# EAGLE board ddk-final-1 (EAGLE 6.4), part 1 of 2
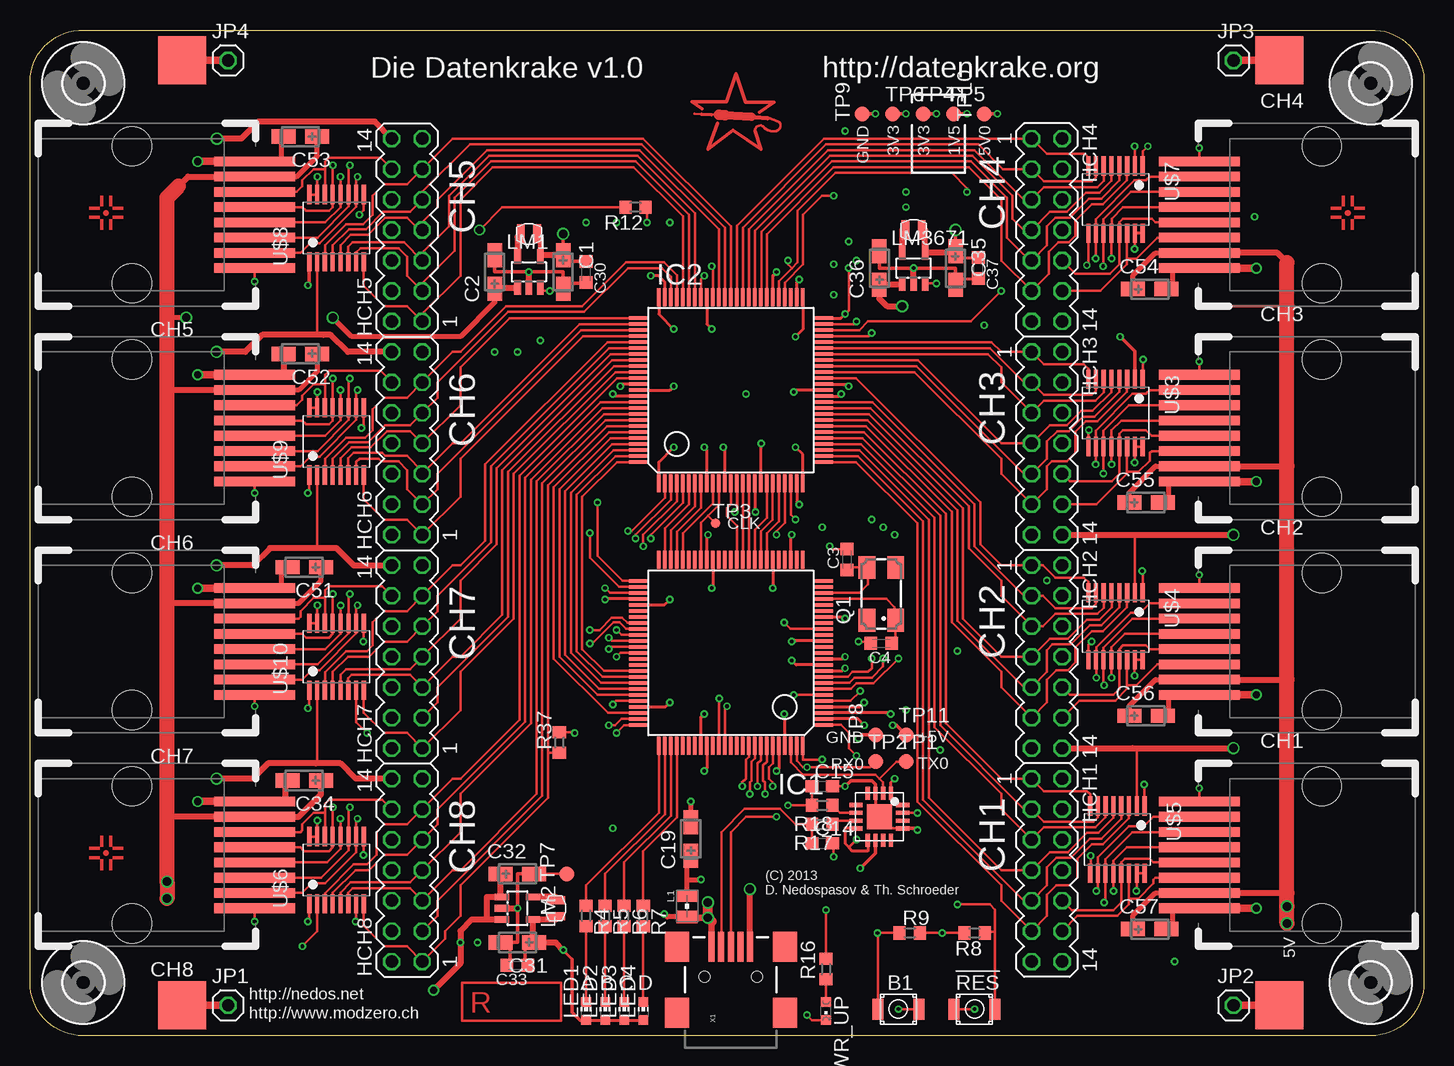
[diagram p5: board, top side]
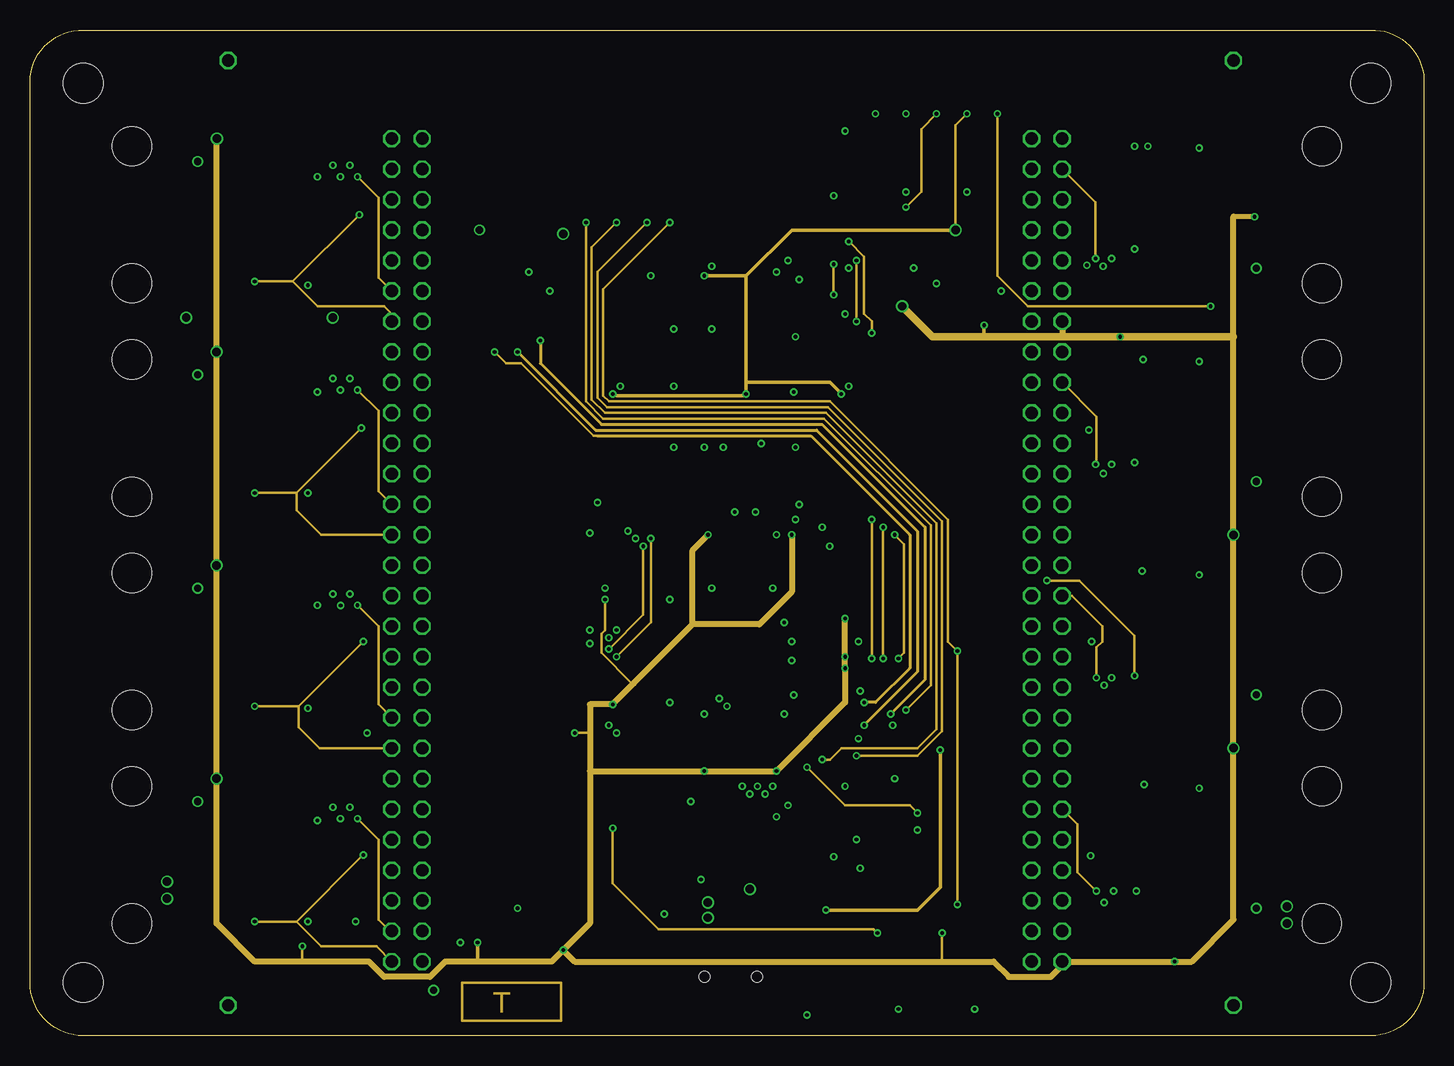
[diagram p6: board, inner layer Route2]
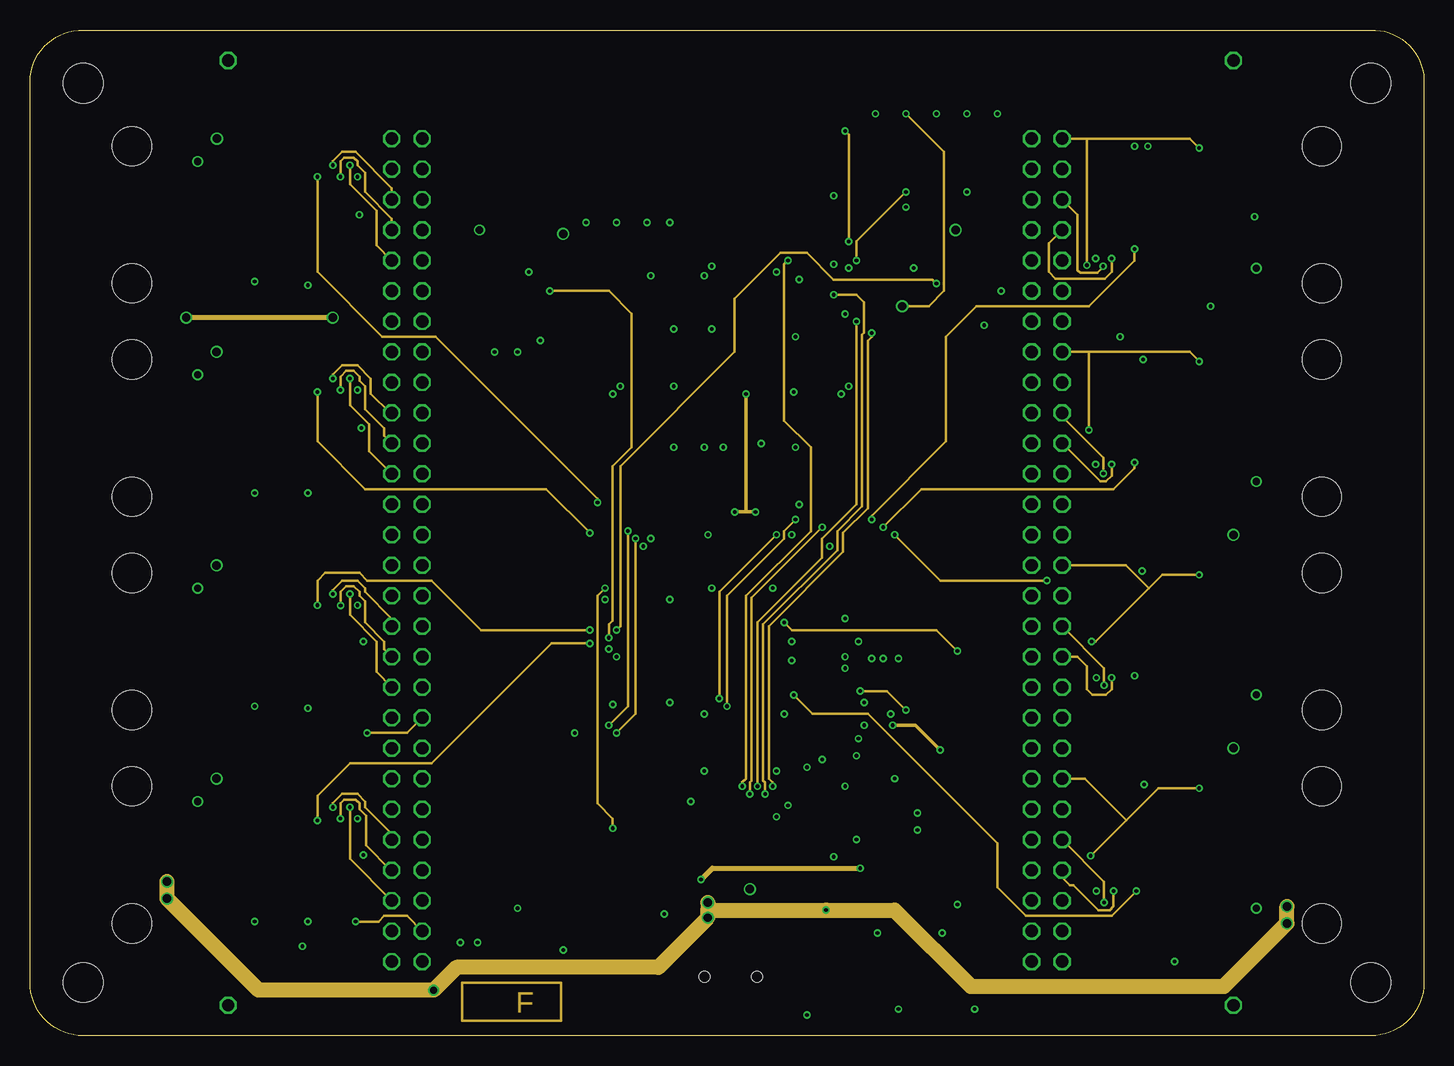
[diagram p7: board, inner layer Route15]
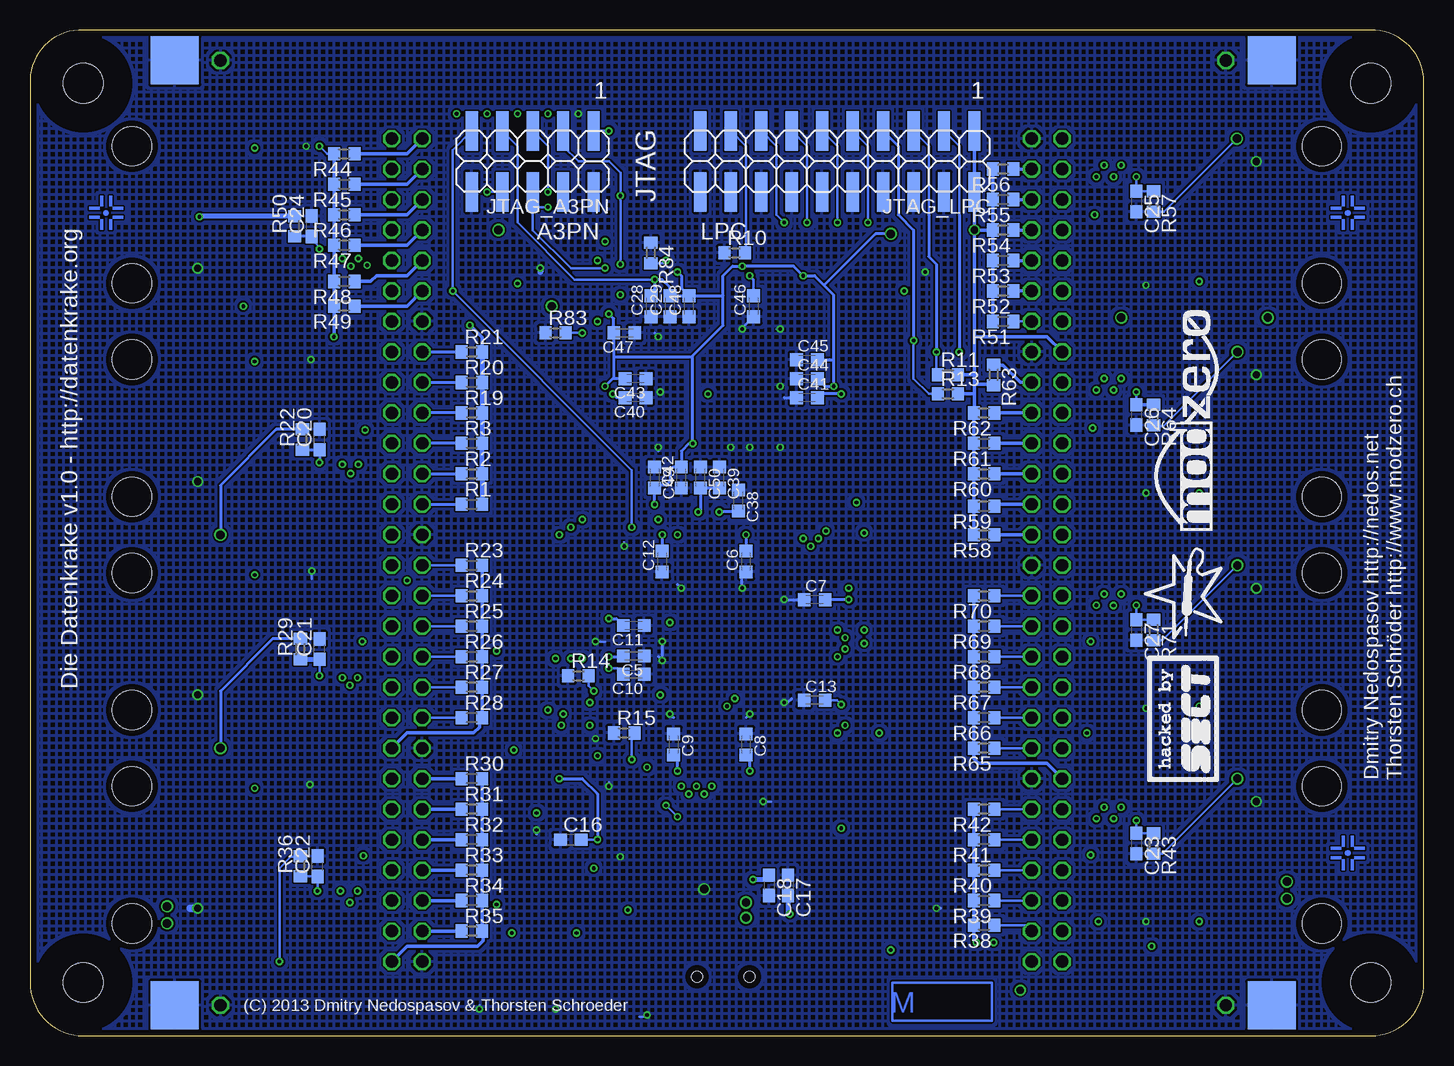
[diagram p8: board, bottom side, seen from below]

Size 116.2 x 83.82 mm. Coordinates in mm from the lower left corner, seen from the top.
Outline: 111.76,83.82 arc-90 116.2,79.69 116.2,4.45 arc-90 111.76,0 4.45,0 arc-90 0,4.45 0,79.53 arc-90 4.45,83.82 111.76,83.82
Copper layers (1+2*15+16): Top 0.035mm / dielectric 0.36mm / Route2 0.035mm / dielectric 0.71mm / Route15 0.035mm / dielectric 0.36mm / Bottom 0.035mm
Design rules "Eagle-DRU - 1203 - LeitOn - 04 layers *": minimum track width 6mil, minimum drill 0.3mm, track to track 6mil, track to pad 6mil, pad to pad 6mil, via to via 6mil, smd to smd 6mil, copper to edge 20mil, drill to drill 10mil, minimum pad ring 8mil, minimum via ring 6mil, stop-mask expansion 3mil, vias tented up to drill 13mil, thermal gap 8mil

## Footprints (pad centres in the part's own frame; a part is rotated, then mirrored left to right if it is on the bottom)
CT3216 = smd 2 x 1.2: + -1.4,0; - 1.4,0
C0603K = smd 1.05 x 1.08: 1 -0.875,0; 2 0.875,0
C0603 = smd 1.1 x 1: 1 -0.85,0; 2 0.85,0
95501 = smd 6.75 x 0.8: P1 -8.255,-4.45; P2 -8.255,-3.175; P3 -8.255,-1.905; P4 -8.255,-0.635; P5 -8.255,0.635; P6 -8.255,1.905; P7 -8.255,3.175; P8 -8.255,4.45 | hole 3.25: 1.97,-5.715; 1.97,5.715
SERIAL_QFN4X4-16 = smd 1.1 x 0.35: 1 -1.95,0.975; 2 -1.95,0.325; 3 -1.95,-0.325; 4 -1.95,-0.975; 9 1.95,-0.975; 10 1.95,-0.325; 11 1.95,0.325; 12 1.95,0.975 | smd 0.35 x 1.1: 5 -0.975,-1.95; 6 -0.325,-1.95; 7 0.325,-1.95; 8 0.975,-1.95; 13 0.975,1.95; 14 0.325,1.95; 15 -0.325,1.95; 16 -0.975,1.95 | smd 2.1 x 2.1: C 0,0
3,3 = hole 3.3: 0,0
MA07-2 = drill 1.016 octagon: 1 -7.62,-1.27; 2 -7.62,1.27; 3 -5.08,-1.27; 4 -5.08,1.27; 5 -2.54,-1.27; 6 -2.54,1.27; 7 0,-1.27; 8 0,1.27; 9 2.54,-1.27; 10 2.54,1.27; 11 5.08,-1.27; 12 5.08,1.27; 13 7.62,-1.27; 14 7.62,1.27
LQFP100-14X14 = smd 0.27 x 1.5: 1 -6,-7.75; 2 -5.5,-7.75; 3 -5,-7.75; 4 -4.5,-7.75; 5 -4,-7.75; 6 -3.5,-7.75; 7 -3,-7.75; 8 -2.5,-7.75; 9 -2,-7.75; 10 -1.5,-7.75; 11 -1,-7.75; 12 -0.5,-7.75; 13 0,-7.75; 14 0.5,-7.75; 15 1,-7.75; 16 1.5,-7.75; 17 2,-7.75; 18 2.5,-7.75; 19 3,-7.75; 20 3.5,-7.75; 21 4,-7.75; 22 4.5,-7.75; 23 5,-7.75; 24 5.5,-7.75; 25 6,-7.75; 51 6,7.75; 52 5.5,7.75; 53 5,7.75; 54 4.5,7.75; 55 4,7.75; 56 3.5,7.75; 57 3,7.75; 58 2.5,7.75; 59 2,7.75; 60 1.5,7.75; 61 1,7.75; 62 0.5,7.75; 63 0,7.75; 64 -0.5,7.75; 65 -1,7.75; 66 -1.5,7.75; 67 -2,7.75; 68 -2.5,7.75; 69 -3,7.75; 70 -3.5,7.75; 71 -4,7.75; 72 -4.5,7.75; 73 -5,7.75; 74 -5.5,7.75; 75 -6,7.75 | smd 1.5 x 0.27: 26 7.75,-6; 27 7.75,-5.5; 28 7.75,-5; 29 7.75,-4.5; 30 7.75,-4; 31 7.75,-3.5; 32 7.75,-3; 33 7.75,-2.5; 34 7.75,-2; 35 7.75,-1.5; 36 7.75,-1; 37 7.75,-0.5; 38 7.75,0; 39 7.75,0.5; 40 7.75,1; 41 7.75,1.5; 42 7.75,2; 43 7.75,2.5; 44 7.75,3; 45 7.75,3.5; 46 7.75,4; 47 7.75,4.5; 48 7.75,5; 49 7.75,5.5; 50 7.75,6; 76 -7.75,6; 77 -7.75,5.5; 78 -7.75,5; 79 -7.75,4.5; 80 -7.75,4; 81 -7.75,3.5; 82 -7.75,3; 83 -7.75,2.5; 84 -7.75,2; 85 -7.75,1.5; 86 -7.75,1; 87 -7.75,0.5; 88 -7.75,0; 89 -7.75,-0.5; 90 -7.75,-1; 91 -7.75,-1.5; 92 -7.75,-2; 93 -7.75,-2.5; 94 -7.75,-3; 95 -7.75,-3.5; 96 -7.75,-4; 97 -7.75,-4.5; 98 -7.75,-5; 99 -7.75,-5.5; 100 -7.75,-6
VQFP100 = smd 0.27 x 1.5: 1 -6,-7.75; 2 -5.5,-7.75; 3 -5,-7.75; 4 -4.5,-7.75; 5 -4,-7.75; 6 -3.5,-7.75; 7 -3,-7.75; 8 -2.5,-7.75; 9 -2,-7.75; 10 -1.5,-7.75; 11 -1,-7.75; 12 -0.5,-7.75; 13 0,-7.75; 14 0.5,-7.75; 15 1,-7.75; 16 1.5,-7.75; 17 2,-7.75; 18 2.5,-7.75; 19 3,-7.75; 20 3.5,-7.75; 21 4,-7.75; 22 4.5,-7.75; 23 5,-7.75; 24 5.5,-7.75; 25 6,-7.75; 51 6,7.75; 52 5.5,7.75; 53 5,7.75; 54 4.5,7.75; 55 4,7.75; 56 3.5,7.75; 57 3,7.75; 58 2.5,7.75; 59 2,7.75; 60 1.5,7.75; 61 1,7.75; 62 0.5,7.75; 63 0,7.75; 64 -0.5,7.75; 65 -1,7.75; 66 -1.5,7.75; 67 -2,7.75; 68 -2.5,7.75; 69 -3,7.75; 70 -3.5,7.75; 71 -4,7.75; 72 -4.5,7.75; 73 -5,7.75; 74 -5.5,7.75; 75 -6,7.75 | smd 1.5 x 0.27: 26 7.75,-6; 27 7.75,-5.5; 28 7.75,-5; 29 7.75,-4.5; 30 7.75,-4; 31 7.75,-3.5; 32 7.75,-3; 33 7.75,-2.5; 34 7.75,-2; 35 7.75,-1.5; 36 7.75,-1; 37 7.75,-0.5; 38 7.75,0; 39 7.75,0.5; 40 7.75,1; 41 7.75,1.5; 42 7.75,2; 43 7.75,2.5; 44 7.75,3; 45 7.75,3.5; 46 7.75,4; 47 7.75,4.5; 48 7.75,5; 49 7.75,5.5; 50 7.75,6; 76 -7.75,6; 77 -7.75,5.5; 78 -7.75,5; 79 -7.75,4.5; 80 -7.75,4; 81 -7.75,3.5; 82 -7.75,3; 83 -7.75,2.5; 84 -7.75,2; 85 -7.75,1.5; 86 -7.75,1; 87 -7.75,0.5; 88 -7.75,0; 89 -7.75,-0.5; 90 -7.75,-1; 91 -7.75,-1.5; 92 -7.75,-2; 93 -7.75,-2.5; 94 -7.75,-3; 95 -7.75,-3.5; 96 -7.75,-4; 97 -7.75,-4.5; 98 -7.75,-5; 99 -7.75,-5.5; 100 -7.75,-6
B3U-1000P = smd 0.914 x 1.778: P$1 -1.7,0; P$2 1.7,0
1X01 = drill 1.016 octagon: 1 0,0
2X05SMD = smd 1.016 x 3.302: 1 -1.27,-3.81; 2 -1.27,1.27; 3 1.27,-3.81; 4 1.27,1.27; 5 3.81,-3.81; 6 3.81,1.27; 7 6.35,-3.81; 8 6.35,1.27; 9 8.89,-3.81; 10 8.89,1.27
2X10SMD = smd 1.016 x 3.302: 1 -1.27,-3.81; 2 -1.27,1.27; 3 1.27,-3.81; 4 1.27,1.27; 5 3.81,-3.81; 6 3.81,1.27; 7 6.35,-3.81; 8 6.35,1.27; 9 8.89,-3.81; 10 8.89,1.27; 11 11.43,-3.81; 12 11.43,1.27; 13 13.97,-3.81; 14 13.97,1.27; 15 16.51,-3.81; 16 16.51,1.27; 17 19.05,-3.81; 18 19.05,1.27; 19 21.59,-3.81; 20 21.59,1.27
WE-KI_0805_B = smd 1.02 x 1.78: 1 -0.89,0; 2 0.89,0
VLS_INDUCTOR = smd 0.65 x 1.6: P$1 -0.67,0; P$2 0.67,0
CHIP-LED0603 = smd 0.8 x 0.8: A 0,-0.75; C 0,0.75
SOT23-5L = smd 0.55 x 1.2: 1 -0.95,-1.3; 2 0,-1.3; 3 0.95,-1.3; 4 0.95,1.3; 5 -0.95,1.3
CHIPLED_0603 = smd 0.8 x 0.8: A 0,-0.75; C 0,0.75
CTS406 = smd 1.9 x 1.4: 1 -2.2,-1.2; 2 2.2,-1.2; 3 2.2,1.2; 4 -2.2,1.2
R0603 = smd 1 x 1.1: 1 -0.85,0; 2 0.85,0
B1,27 = smd 1.27 x 1.27: TP 0,0
TP08R = smd 0.8 x 0.8: TP 0,0
TSSOP16 = smd 0.35 x 1.6: P$1 -2.268,-2.8; P$2 -1.617,-2.8; P$3 -0.968,-2.8; P$4 -0.318,-2.8; P$5 0.333,-2.8; P$6 0.983,-2.8; P$7 1.633,-2.8; P$8 2.268,-2.8; P$9 2.268,2.8; P$10 1.633,2.8; P$11 1.012,2.8; P$12 0.333,2.8; P$13 -0.318,2.8; P$14 -0.968,2.8; P$15 -1.617,2.8; P$16 -2.268,2.8
GNDPAD = smd 4 x 4: P$1 0,0
USB-MINIB = smd 2.5 x 0.5: D+ 2.5,0; D- 2.5,0.8; GND 2.5,-1.6; ID 2.5,-0.8; VBUS 2.5,1.6 | smd 2.5 x 2: GND@1 -3,-4.5; GND@2 -3,4.5; GND@3 2.5,4.5; GND@4 2.5,-4.5 | hole 0.9: 0,2.2; 0,-2.2

## Placement (x,y rotation side)
C1  10u  [CT3216]  44.45,63.66 270 top
C2  47u  [CT3216]  38.73,63.66 90 top
C3  22p  [C0603K]  68.1,39.69 90 top
C4  22p  [C0603K]  70.96,32.7 180 top
C5  100n  [C0603K]  65.88,31.65 180 bottom
C6  100n  [C0603K]  56.52,39.53 90 bottom
C7  100n  [C0603K]  50.8,36.35 0 bottom
C8  100n  [C0603K]  56.52,24.29 270 bottom
C9  100n  [C0603K]  62.55,24.29 270 bottom
C10  100n  [C0603K]  65.88,30.13 180 bottom
C11  100n  [C0603K]  65.88,34.19 180 bottom
C12  100n  [C0603K]  63.5,39.53 90 bottom
C13  100n  [C0603K]  50.8,27.97 0 bottom
C14  47p  [C0603]  66.04,16.03 0 top
C15  47p  [C0603]  66.04,20.8 0 top
C16  100n  [C0603]  71.12,16.35 0 bottom
C17  10n  [C0603]  53.02,12.54 270 bottom
C18  100n  [C0603]  54.61,12.54 270 bottom
C19  TA 10u  [CT3216]  55.09,16.41 90 top
C20  100n  [C0603]  92.08,49.69 90 bottom
C21  100n  [C0603]  92.08,32.23 90 bottom
C22  100n  [C0603]  92.23,14.13 90 bottom
C23  100n  [C0603]  23.97,16.03 270 bottom
C24  100n  [C0603]  92.71,67.47 90 bottom
C25  100n  [C0603]  23.97,69.53 270 bottom
C26  100n  [C0603]  23.97,51.75 270 bottom
C27  100n  [C0603]  23.97,33.81 270 bottom
C28  10n  [C0603K]  64.45,60.8 90 bottom
C29  330n  [C0603K]  62.87,60.8 90 bottom
C30  100n  [C0603K]  46.35,63.66 270 top
C31  10u  [CT3216]  40.64,7.78 180 top
C32  47u  [CT3216]  40.64,13.49 0 top
C33  100n  [C0603K]  40.64,5.87 180 top
C34  10u  [CT3216]  22.86,21.27 180 top
C35  10u  [CT3216]  77.15,63.98 270 top
C36  47u  [CT3216]  70.8,63.98 90 top
C37  100n  [C0603K]  79.06,63.98 270 top
C38  100n  [C0603K]  57.15,44.61 270 bottom
C39  100n  [C0603K]  58.74,46.51 270 bottom
C40  100n  [C0603K]  65.72,53.18 180 bottom
C41  100n  [C0603K]  51.44,53.18 0 bottom
C42  100n  [C0603K]  61.91,46.51 90 bottom
C43  100n  [C0603K]  65.72,54.77 180 bottom
C44  100n  [C0603K]  51.44,54.77 0 bottom
C45  100n  [C0603K]  51.44,56.36 0 bottom
C46  100n  [C0603K]  55.88,60.8 90 bottom
C47  100n  [C0603K]  66.67,58.58 180 bottom
C48  100n  [C0603K]  61.28,60.8 90 bottom
C49  100n  [C0603K]  64.14,46.51 270 bottom
C50  10n  [C0603K]  60.33,46.51 270 bottom
C51  10u  [CT3216]  22.86,39.05 180 top
C52  10u  [CT3216]  22.54,56.83 180 top
C53  10u  [CT3216]  22.54,74.93 180 top
C54  10u  [CT3216]  93.34,62.23 0 top
C55  10u  [CT3216]  93.03,44.45 0 top
C56  10u  [CT3216]  93.03,26.67 0 top
C57  10u  [CT3216]  93.34,8.89 0 top
CH1  955XX-86889  [95501]  105.73,15.08 0 top
CH2  955XX-86889  [95501]  105.73,32.86 0 top
CH3  955XX-86889  [95501]  105.73,50.64 0 top
CH4  955XX-86889  [95501]  105.73,68.42 0 top
CH5  955XX-86889  [95501]  10.48,68.42 180 top
CH6  955XX-86889  [95501]  10.48,50.64 180 top
CH7  955XX-86889  [95501]  10.48,32.86 180 top
CH8  955XX-86889  [95501]  10.48,15.08 180 top
FT230X  SERIAL_FT230XQ  [SERIAL_QFN4X4-16]  70.8,18.26 270 top
H1  MOUNT-HOLE3.3  [3,3]  4.45,4.45 0 top
H2  MOUNT-HOLE3.3  [3,3]  111.76,4.45 0 top
H3  MOUNT-HOLE3.3  [3,3]  4.45,79.38 0 top
H4  MOUNT-HOLE3.3  [3,3]  111.76,79.38 0 top
HCH1  [MA07-2]  84.77,13.81 270 top
HCH2  [MA07-2]  84.77,31.59 270 top
HCH3  [MA07-2]  84.77,49.37 270 top
HCH4  [MA07-2]  84.77,67.15 270 top
HCH5  [MA07-2]  31.43,67.15 90 top
HCH6  [MA07-2]  31.43,49.37 90 top
HCH7  [MA07-2]  31.43,31.59 90 top
HCH8  [MA07-2]  31.43,13.81 90 top
IC1  LPC1765  [LQFP100-14X14]  58.42,31.91 90 top
IC2  PROASIC3_NANO_A3PN125  [VQFP100]  58.42,53.82 0 top
ISP  [B3U-1000P]  72.39,2.22 180 top
JP1  [1X01]  16.51,2.54 0 top
JP2  [1X01]  100.33,2.54 0 top
JP3  [1X01]  100.33,81.28 0 top
JP4  [1X01]  16.51,81.28 0 top
JTAG_A3PN  [2X05SMD]  70.48,71.6 180 bottom
JTAG_LPC  [2X10SMD]  38.73,71.6 180 bottom
L1  10µH  [WE-KI_0805_B]  54.77,10.79 270 top
L2  2.2uH  [VLS_INDUCTOR]  73.66,67.15 0 top
L3  2.2uH  [VLS_INDUCTOR]  41.59,66.83 0 top
L4  2.2uH  [VLS_INDUCTOR]  43.81,10.64 270 top
LED1  RED  [CHIP-LED0603]  46.35,2.06 0 top
LED2  RED  [CHIP-LED0603]  47.94,2.06 0 top
LED3  RED  [CHIP-LED0603]  49.53,2.06 0 top
LED4  RED  [CHIP-LED0603]  51.12,2.06 0 top
LM1  LM3671_3V3IO  [SOT23-5L]  41.59,63.66 0 top
LM2  LM3671_3V3_LPC  [SOT23-5L]  40.64,10.64 270 top
LM3671  LM3671_1V5  [SOT23-5L]  73.66,63.98 0 top
PWR_UP  GREEN  [CHIPLED_0603]  66.36,2.06 180 top
Q1  12MHz  [CTS406]  70.96,36.83 90 top
R1  330  [R0603]  79.38,44.29 0 bottom
R2  330  [R0603]  79.38,46.83 0 bottom
R3  330  [R0603]  79.38,49.37 0 bottom
R4  270  [R0603]  46.35,10 270 top
R5  270  [R0603]  47.94,10 270 top
R6  270  [R0603]  49.53,10 270 top
R7  270  [R0603]  51.12,10 270 top
R8  47k  [R0603]  78.74,8.57 180 top
R9  47k  [R0603]  73.34,8.57 0 top
R10  10k  [R0603]  57.47,65.25 0 bottom
R11  10k  [R0603]  39.69,55.09 0 bottom
R12  10k  [R0603]  50.48,69.06 180 top
R13  10k  [R0603]  39.69,53.5 0 bottom
R14  10k  [R0603]  70.48,30 0 bottom
R15  10k  [R0603]  66.67,25.24 0 bottom
R16  680  [R0603]  66.36,5.56 90 top
R17  27  [R0603]  66.04,17.62 180 top
R18  27  [R0603]  66.04,19.21 180 top
R19  330  [R0603]  79.38,51.91 0 bottom
R20  330  [R0603]  79.38,54.45 0 bottom
R21  330  [R0603]  79.38,56.99 0 bottom
R22  200k  [R0603]  93.5,49.69 90 bottom
R23  330  [R0603]  79.38,39.21 0 bottom
R24  330  [R0603]  79.38,36.67 0 bottom
R25  330  [R0603]  79.38,34.13 0 bottom
R26  330  [R0603]  79.38,31.59 0 bottom
R27  330  [R0603]  79.38,29.05 0 bottom
R28  330  [R0603]  79.38,26.51 0 bottom
R29  200k  [R0603]  93.66,32.23 90 bottom
R30  330  [R0603]  79.38,21.43 0 bottom
R31  330  [R0603]  79.38,18.89 0 bottom
R32  330  [R0603]  79.38,16.35 0 bottom
R33  330  [R0603]  79.38,13.81 0 bottom
R34  330  [R0603]  79.38,11.27 0 bottom
R35  330  [R0603]  79.38,8.73 0 bottom
R36  200k  [R0603]  93.66,14.13 90 bottom
R37  330  [R0603]  44.13,24.45 90 top
R38  330  [R0603]  36.67,9.21 180 bottom
R39  330  [R0603]  36.67,11.27 180 bottom
R40  330  [R0603]  36.67,13.81 180 bottom
R41  330  [R0603]  36.67,16.35 180 bottom
R42  330  [R0603]  36.67,18.89 180 bottom
R43  200k  [R0603]  22.54,16.03 270 bottom
R44  330  [R0603]  90.01,73.5 180 bottom
R45  330  [R0603]  90.01,70.96 180 bottom
R46  330  [R0603]  90.01,68.42 180 bottom
R47  330  [R0603]  90.01,65.88 180 bottom
R48  330  [R0603]  90.01,62.87 180 bottom
R49  330  [R0603]  90.01,60.8 180 bottom
R50  200k  [R0603]  94.14,67.47 90 bottom
R51  330  [R0603]  35.08,59.53 180 bottom
R52  330  [R0603]  35.08,62.07 180 bottom
R53  330  [R0603]  35.08,64.61 180 bottom
R54  330  [R0603]  35.08,67.15 180 bottom
R55  330  [R0603]  35.08,69.69 180 bottom
R56  330  [R0603]  35.08,72.23 180 bottom
R57  200k  [R0603]  22.54,69.53 270 bottom
R58  330  [R0603]  36.67,41.75 180 bottom
R59  330  [R0603]  36.67,44.13 180 bottom
R60  330  [R0603]  36.67,46.83 180 bottom
R61  330  [R0603]  36.67,49.37 180 bottom
R62  330  [R0603]  36.67,51.91 180 bottom
R63  330  [R0603]  35.88,55.09 270 bottom
R64  200k  [R0603]  22.54,51.75 270 bottom
R65  330  [R0603]  36.67,23.97 180 bottom
R66  330  [R0603]  36.67,26.51 180 bottom
R67  330  [R0603]  36.67,29.05 180 bottom
R68  330  [R0603]  36.67,31.59 180 bottom
R69  330  [R0603]  36.67,34.13 180 bottom
R70  330  [R0603]  36.67,36.67 180 bottom
R71  200k  [R0603]  22.54,33.81 270 bottom
R83  10k  [R0603]  72.39,58.58 0 bottom
R84  10k  [R0603]  64.45,65.25 270 bottom
RESET  [B3U-1000P]  78.74,2.22 0 top
TP1  PTR1B1,27  [B1,27]  73.03,22.86 0 top
TP2  PTR1B1,27  [B1,27]  70.48,22.86 0 top
TP3  PTR1TP08R  [TP08R]  57.15,42.7 0 top
TP4  PTR1B1,27  [B1,27]  74.45,76.83 0 top
TP5  PTR1B1,27  [B1,27]  76.99,76.83 0 top
TP6  PTR1B1,27  [B1,27]  71.91,76.83 0 top
TP7  PTR1B1,27  [B1,27]  44.77,13.49 90 top
TP8  PTR1B1,27  [B1,27]  70.48,25.08 90 top
TP9  PTR1B1,27  [B1,27]  69.37,76.83 90 top
TP10  PTR1B1,27  [B1,27]  79.53,76.83 90 top
TP11  PTR1B1,27  [B1,27]  73.03,25.08 0 top
U$1  [LOGO_SMALL]  54.93,73.03 0 top
U$3  NVT2006  [TSSOP16]  90.49,51.91 180 top
U$4  NVT2006  [TSSOP16]  90.49,34.13 180 top
U$5  NVT2006  [TSSOP16]  90.65,16.35 180 top
U$6  NVT2006  [TSSOP16]  25.56,13.81 0 top
U$7  NVT2006  [TSSOP16]  90.49,69.69 180 top
U$8  NVT2006  [TSSOP16]  25.56,67.31 0 top
U$9  NVT2006  [TSSOP16]  25.56,49.53 0 top
U$10  NVT2006  [TSSOP16]  25.56,31.59 0 top
U$11  GNDPAD_4MM  [GNDPAD]  12.7,2.54 0 top
U$12  GNDPAD_4MM  [GNDPAD]  104.14,2.54 0 top
U$13  GNDPAD_4MM  [GNDPAD]  12.7,81.28 0 top
U$14  GNDPAD_4MM  [GNDPAD]  104.14,81.28 0 top
U$15  GNDPAD_4MM  [GNDPAD]  12.7,2.54 0 bottom
U$16  GNDPAD_4MM  [GNDPAD]  104.14,2.54 0 bottom
U$17  GNDPAD_4MM  [GNDPAD]  12.7,81.28 0 bottom
U$18  GNDPAD_4MM  [GNDPAD]  104.14,81.28 0 bottom
U$19  [LOGO_SMALL_TPLACE]  19.88,36.74 90 bottom
U$20  [PASSER-MARK]  6.35,15.24 0 top
U$21  [PASSER-MARK]  109.86,68.58 0 top
U$22  [PASSER-MARK]  6.35,68.58 0 top
X1  USBSMD  [USB-MINIB]  58.42,4.92 90 top